# EAGLE design I2C_iso_mini_v30 (EAGLE 7.6.0)
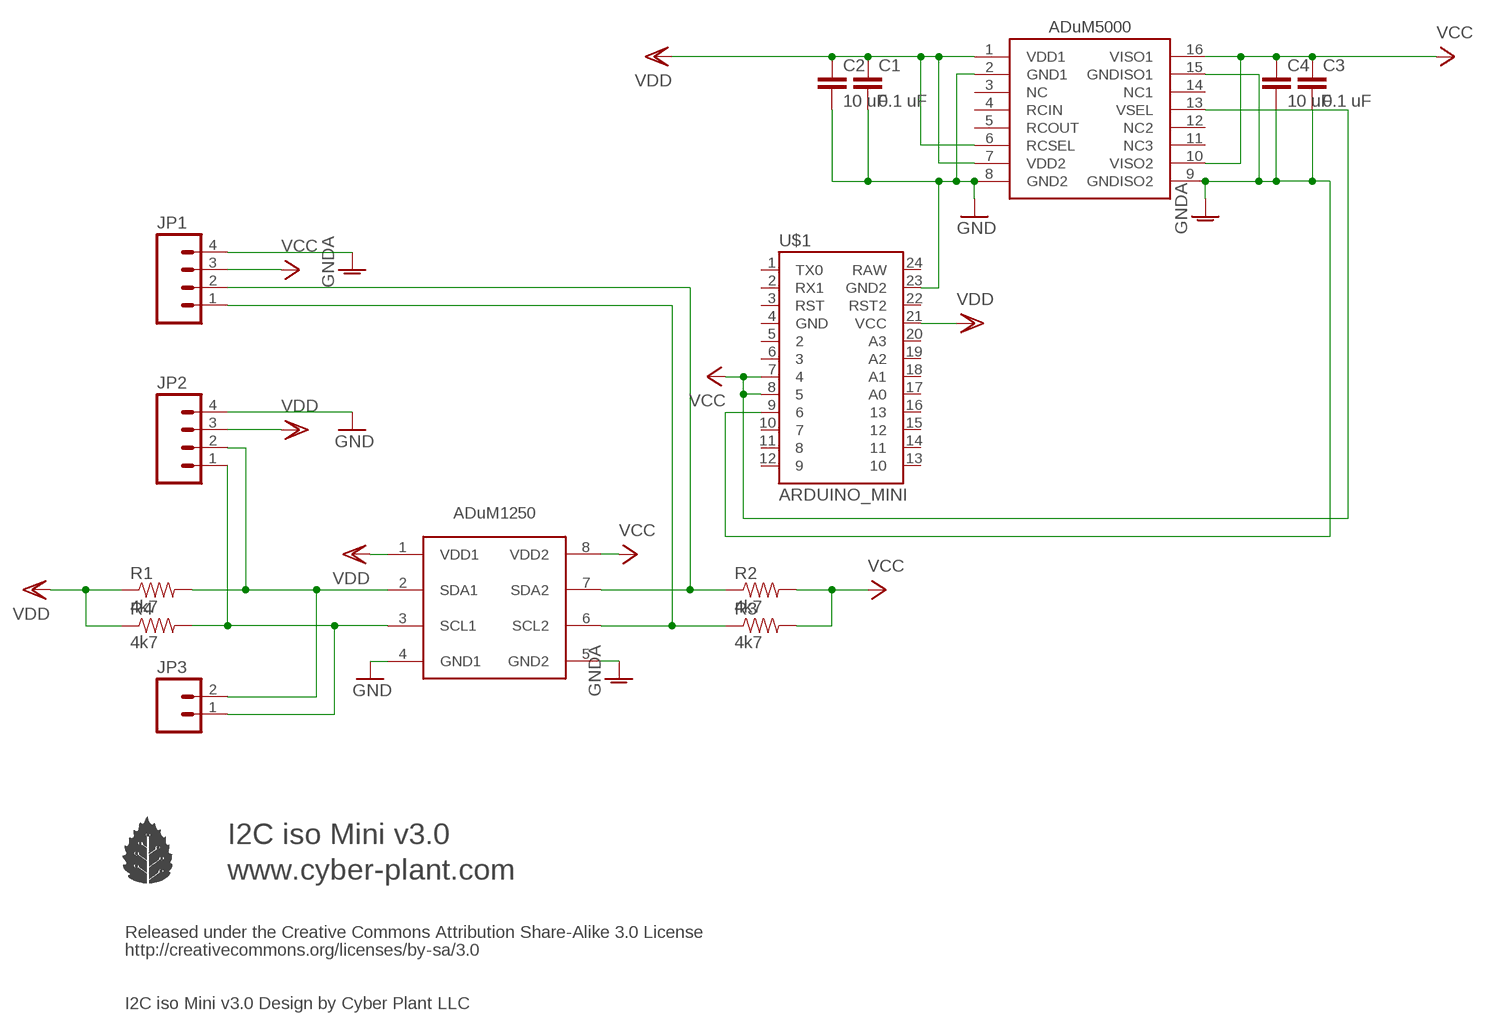
[diagram p0: schematic, sheet 1]

## Parts
C1  0.1 uF  CAP1206  [1206]
C2  10 uF  CAP1206  [1206]
C3  0.1 uF  CAP1206  [1206]
C4  10 uF  CAP1206  [1206]
JP1  M04PTH  [1X04]
JP2  M04PTH  [1X04]
JP3  M02PTH  [1X02]
R1  4k7  RESISTOR1206  [1206]
R2  4k7  RESISTOR1206  [1206]
R3  4k7  RESISTOR1206  [1206]
R4  4k7  RESISTOR1206  [1206]
U$1  ARDUINO_MINI  [ARDUINO_MINI]
U$3  ADUM1251  [SO8]
U$4  ADUM5000  [SO-16W]

## Nets
GND: C1.2 C2.2 JP2.4 U$1.23(GND2) U$3.4(GND1) U$4.2(GND1) U$4.8(GND2)
GNDA: C3.2 C4.2 JP1.4 U$1.9 U$3.5(GND2) U$4.9(GNDISO2) U$4.15(GNDISO1)
SCL: JP2.1 JP3.1 R4.2 U$3.3(SCL1)
SCL2: JP1.1 R3.1 U$3.6(SCL2)
SDA: JP2.2 JP3.2 R1.2 U$3.2(SDA1)
SDA2: JP1.2 R2.1 U$3.7(SDA2)
VCC: C3.1 C4.1 JP1.3 R2.2 R3.2 U$1.7 U$1.8 U$3.8(VDD2) U$4.10(VISO2) U$4.13(VSEL) U$4.16(VISO1)
VDD: C1.1 C2.1 JP2.3 R1.1 R4.1 U$1.21(VCC) U$3.1(VDD1) U$4.1(VDD1) U$4.6(RCSEL) U$4.7(VDD2)
Unconnected: U$1.1(TX0) U$1.2(RX1) U$1.3(RST) U$1.4(GND) U$1.5 U$1.6 U$1.10 U$1.11 U$1.12 U$1.13 U$1.14 U$1.15 U$1.16 U$1.17(A0) U$1.18(A1) U$1.19(A2) U$1.20(A3) U$1.22(RST2) U$1.24(RAW) U$4.3(NC) U$4.4(RCIN) U$4.5(RCOUT) U$4.11(NC3) U$4.12(NC2) U$4.14(NC1)

## Notes on the sheet
- I2C iso Mini v3.0
- www.cyber-plant.com
- Released under the Creative Commons Attribution Share-Alike 3.0 License
- http://creativecommons.org/licenses/by-sa/3.0
- I2C iso Mini v3.0 Design by Cyber Plant LLC

## Library data of the parts
C1-C4 = SparkFun:CAP: Capacitor Standard 0603 ceramic capacitor, and 0.1" leaded capacitor.
JP1 JP2 = Arduinominimi:M04: Header 4 Standard 4-pin 0.1" header. Use with straight break away headers (SKU : PRT-00116), right angle break away headers (PRT-00553), swiss pins (PRT-00743), machine pins (PRT-00117), and female headers (PRT-00115). Molex polarized connector foot print use with SKU : PRT-08231 with associated crimp pins and housings. 1MM SMD Version SKU: PRT-10208
JP3 = Arduinominimi:M02: Header 2 Standard 2-pin 0.1" header. Use with straight break away headers (SKU : PRT-00116), right angle break away headers (PRT-00553), swiss pins (PRT-00743), machine pins (PRT-00117), and female headers (PRT-00115). Molex polarized connector foot print use with SKU : PRT-08233 with associated crimp pins and housings.
R1-R4 = SparkFun:RESISTOR: Resistor Basic schematic elements and footprints for 0603, 1206, and PTH resistors.; PROD_ID: RES-00824
U$1 = Arduinominimi:ARDUINO_MINI
U$3 = ADuM1250:ADUM1251
U$4 = ADuM5000:ADUM5000

## Board
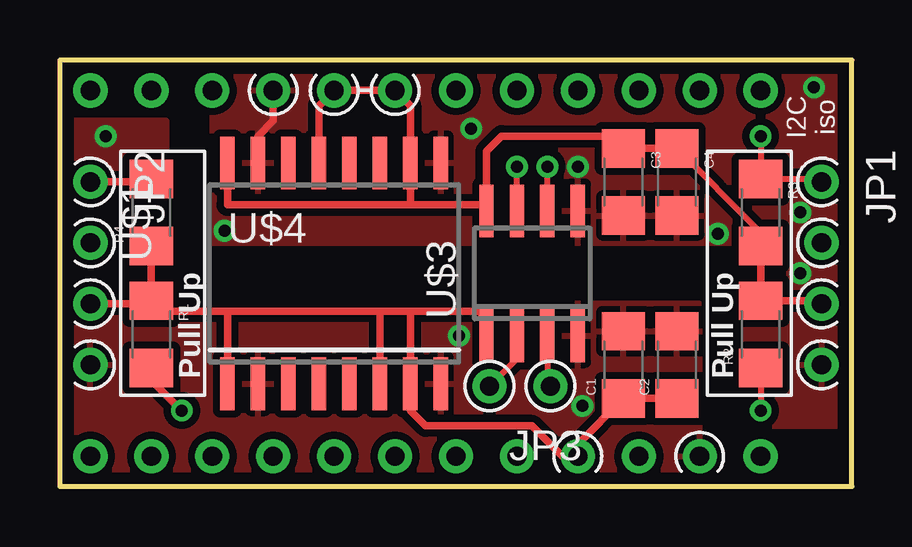
[diagram p1: board, top side]
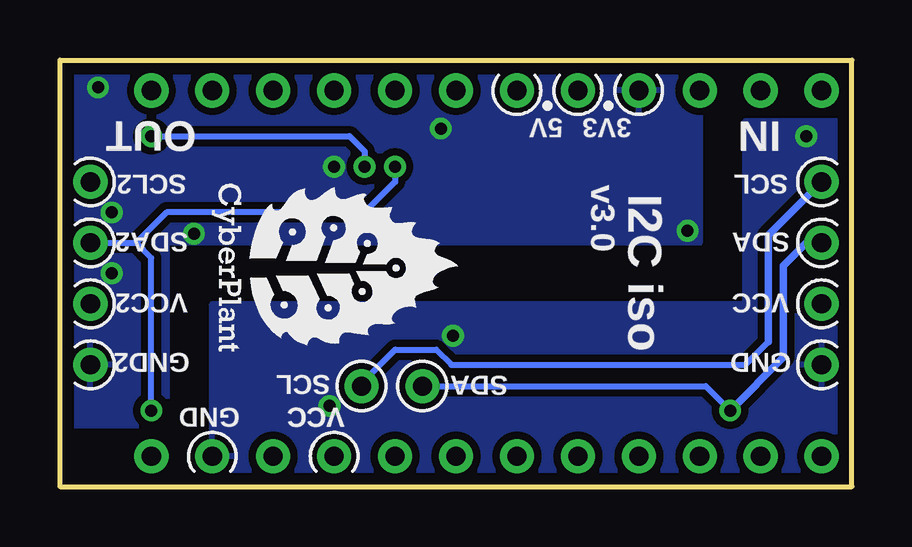
[diagram p2: board, bottom side, seen from below]

Size 33.02 x 17.78 mm. Coordinates in mm from the lower left corner, seen from the top.
Outline: 33.02,0 33.02,17.78 0,17.78 0,0 33.02,0
Copper layers (1*16): Top 0.035mm / dielectric 1.5mm / Bottom 0.035mm
Design rules "default *": minimum track width 6mil, minimum drill 12mil, track to track 8mil, track to pad 8mil, pad to pad 8mil, via to via 8mil, smd to smd 8mil, copper to edge 0.48mm, drill to drill 12mil, minimum pad ring 10mil, minimum via ring 8mil, stop-mask expansion 4mil, vias tented up to drill 20mil, thermal gap 10mil

### Footprints (pad centres in the part's own frame; a part is rotated, then mirrored left to right if it is on the bottom)
1206 = smd 1.6 x 1.8: 1 -1.4,0; 2 1.4,0
1X04 = drill 0.8 pad 1.422: 1 0,0; 2 2.54,0; 3 5.08,0; 4 7.62,0
1X02 = drill 0.8 pad 1.422: 1 0,0; 2 2.54,0
ARDUINO_MINI = drill 0.8 pad 1.422: 1 -7.62,12.7; 2 -7.62,10.16; 3 -7.62,7.62; 4 -7.62,5.08; 5 -7.62,2.54; 6 -7.62,0; 7 -7.62,-2.54; 8 -7.62,-5.08; 9 -7.62,-7.62; 10 -7.62,-10.16; 11 -7.62,-12.7; 12 -7.62,-15.24; 13 7.62,-15.24; 14 7.62,-12.7; 15 7.62,-10.16; 16 7.62,-7.62; 17 7.62,-5.08; 18 7.62,-2.54; 19 7.62,0; 20 7.62,2.54; 21 7.62,5.08; 22 7.62,7.62; 23 7.62,10.16; 24 7.62,12.7
SO8 = smd 0.6 x 2.2: 1 -1.905,-2.6; 2 -0.635,-2.6; 3 0.635,-2.6; 4 1.905,-2.6; 5 1.905,2.6; 6 0.635,2.6; 7 -0.635,2.6; 8 -1.905,2.6
SO-16W = smd 0.6 x 2.2: 1 -4.445,-4.6; 2 -3.175,-4.6; 3 -1.905,-4.6; 4 -0.635,-4.6; 5 0.635,-4.6; 6 1.905,-4.6; 7 3.175,-4.6; 8 4.445,-4.6; 9 4.445,4.6; 10 3.175,4.6; 11 1.905,4.6; 12 0.635,4.6; 13 -0.635,4.6; 14 -1.905,4.6; 15 -3.175,4.6; 16 -4.445,4.6

### Placement (x,y rotation side)
C1  23.49,5.08 90 top
C2  25.72,5.08 90 top
C3  23.49,12.7 270 top
C4  25.72,12.7 270 top
JP1  31.75,12.7 270 top
JP2  1.27,12.7 270 top
JP3  20.45,4.19 180 top
R1  3.81,6.35 270 top
R2  29.21,6.35 90 top
R3  29.21,11.43 270 top
R4  3.81,11.43 90 top
U$1  16.51,8.89 270 top
U$3  19.68,8.89 0 top
U$4  11.43,8.89 0 top

### Tracks (layer width: path | path; a pad name or v marks a point on that pad's centre or on a via)
GND  (via drill 0.5)
  other vias: 21.78,3.37 16.64,6.29 1.91,14.6
  pour Top (isolate 0.305): 26.67,7.62 4.45,7.62 4.45,15.24 0,15.24 0,0 26.67,0
  pour Bottom (isolate 0.305): 26.67,7.62 4.45,7.62 4.45,15.24 0,15.24 0,0 26.67,0
GNDA  (via drill 0.5)
  Top 0.305: U$4.15 8.25,14.6 8.89,15.24 U$1.9
  other vias: 17.14,14.92 21.59,13.33 30.86,8.89 30.86,11.43 31.43,16.64 27.43,10.54 6.86,10.67
  pour Bottom (isolate 0.305): 6.35,17.78 6.35,10.16 28.58,10.16 28.58,2.54 33.02,2.54 33.02,17.78
  pour Top (isolate 0.305): 6.35,17.78 6.35,10.16 28.58,10.16 28.58,2.54 33.02,2.54 33.02,17.78
SCL
  Top 0.254: U$3.3 20.32,4.32 JP3.1
  Top 0.305: JP2.1 3.68,12.7 R4.2
  Bottom 0.254: JP3.1 20.45,4.32 19.05,5.71 17.34,5.71 16.7,5.08 4.45,5.08 3.49,6.03
  Bottom 0.305: JP2.1 3.49,10.48 3.49,6.03
SCL2  (via drill 0.5)
  Top 0.254: U$3.6 v20.32,13.33 | 31.75,12.57 JP1.1 31.62,12.83 R3.1 v29.21,14.6
  Bottom 0.254: v29.21,14.6 20.95,14.6 20.32,13.97 v20.32,13.33
SDA  (via drill 0.5)
  Top 0.254: U$3.2 19.05,5.33 JP3.2
  Top 0.305: R1.2 3.81,4.44 v5.08,3.17
  Bottom 0.254: JP3.2 6.1,4.19 v5.08,3.17
  Bottom 0.305: JP2.2 1.91,10.16 2.86,9.21 2.86,5.4 v5.08,3.17
SDA2  (via drill 0.5)
  Top 0.254: U$3.7 v19.05,13.33 | R2.1 v29.21,3.17
  Bottom 0.254: v19.05,13.33 19.05,12.7 20.32,11.43 28.58,11.43 29.84,10.16 | JP1.2 29.84,10.16 | v29.21,3.17 29.21,9.53 29.84,10.16
VCC
  Top 0.254: 26.22,14.6 25.91,14.29 C4.1 29.08,10.74 29.08,10.16 | 23.31,14.6 23.31,14.29 C3.1
  Top 0.305: C4.1 C3.1 | 17.72,11.43 U$3.8 17.78,11.75 | 25.91,14.29 26.35,14.29 | 29.08,10.16 R3.2 R2.2 31.62,7.75 JP1.3 | 23.31,14.6 18.41,14.6 17.78,13.97 17.78,11.75 | U$4.13 10.8,15.87 U$1.8 U$1.7 14.61,15.87 U$4.10 14.61,11.75 | U$4.16 6.98,11.75 14.61,11.75 | 14.61,11.75 17.78,11.75
VDD
  Top 0.305: JP2.3 3.68,7.62 R1.1 | R4.1 R1.1 | 17.78,6.35 U$3.1 17.78,6.99 17.46,7.3 14.61,7.3 | C2.1 C1.1 21.59,1.78 U$1.21 20.95,1.27 19.68,2.54 15.24,2.54 14.61,3.17 U$4.7 14.61,7.3 | R1.1 3.81,7.3 | 14.61,7.3 13.34,7.3 | 13.34,7.3 6.98,7.3 | 6.98,7.3 4.26,7.3 R1.1 | U$4.1 6.98,7.3 | U$4.6 13.34,7.3

### Text on the board
tPlace: I2C / iso | Pull Up | Pull Up
bPlace: IN | 3V3 | 5V | OUT | SCL | SCL2 | SDA | v3.0 | SDA2 | I2C iso | VCC | VCC2 | GND | GND2 | SDA | SCL | VCC | VCC | GND